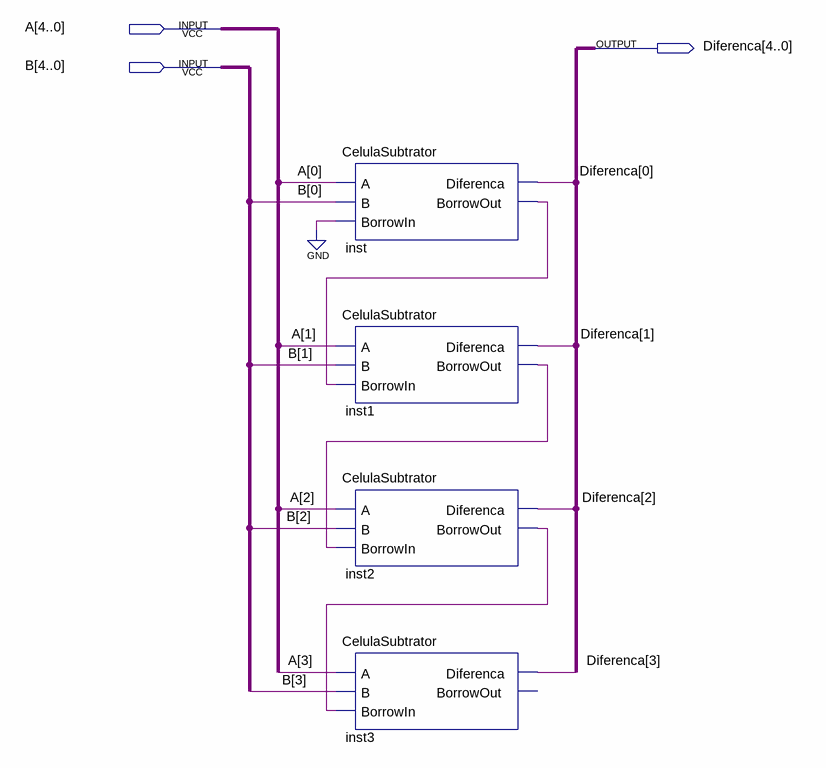
[diagram p0: schematic sheet]
// Quartus schematic SubtratorCompleto.bdf as structural Verilog: 4 symbols, 3 pins
module SubtratorCompleto (
  input  [4:0] A,
  input  [4:0] B,
  output [4:0] Diferenca
);

  wire inst1_borrowout, inst2_borrowout, inst_borrowout;

  CelulaSubtrator inst (.A(A[0]), .B(B[0]), .BorrowIn(1'b0), .Diferenca(Diferenca[0]), .BorrowOut(inst_borrowout));
  CelulaSubtrator inst1 (
    .A(A[1]), .B(B[1]), .BorrowIn(inst_borrowout), .Diferenca(Diferenca[1]), .BorrowOut(inst1_borrowout));
  CelulaSubtrator inst2 (
    .A(A[2]), .B(B[2]), .BorrowIn(inst1_borrowout), .Diferenca(Diferenca[2]), .BorrowOut(inst2_borrowout));
  CelulaSubtrator inst3 (.A(A[3]), .B(B[3]), .BorrowIn(inst2_borrowout), .Diferenca(Diferenca[3]));  // open: BorrowOut
endmodule
